# EasyEDA schematic SCH_SENSORS_IRC_2024-07-05.json
TITLE: Sheet_1; REV: 1.0; Date: 2024-07-05; Sheet: 1/1; Company: Your Company
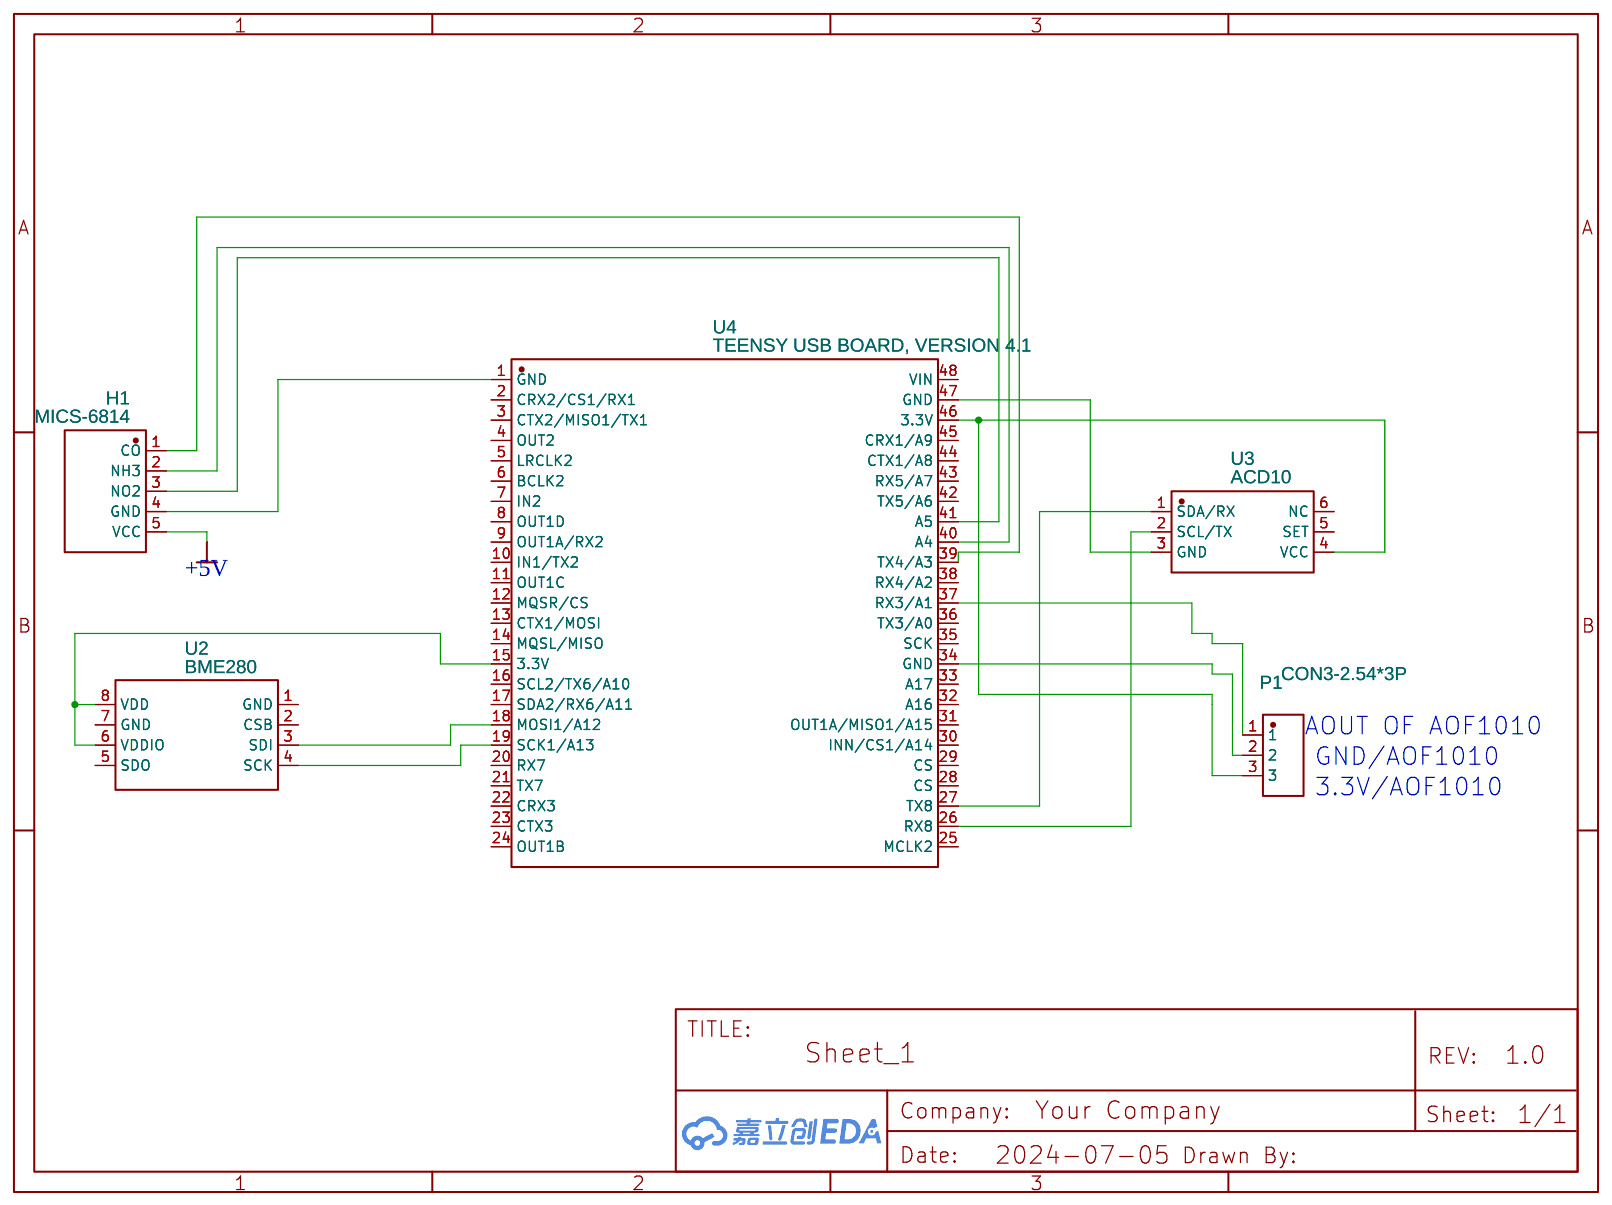
[diagram p0: schematic sheet]

## Parts
H1  MICS-6814  [MICS-6814]
P1  CON3-2.54*3P  [CONN-TH_XH2.54-3P]
U2  BME280  [LGA-8_BME280_BL]
U3  ACD10  [SENSOR-TH_ACD10]
U4  TEENSY USB BOARD, VERSION 4.1  [COMM-TH_L61.0-W17.8-P2.54]

## Library data of the parts
H1 = MICS-6814: Contributor: vbondarhuk
P1 = CON3-2.54*3P: Contributor: LCSC; Supplier: LCSC; Supplier Part: C9900003185; Manufacturer: null
U2 = BME280: Contributor: LCSC; Supplier: LCSC; Manufacturer: Bosch(博世); Supplier Part: C92489; JLCPCB Part Class: Extended Part
U3 = ACD10: Supplier: LCSC; Supplier Part: C3012634; Manufacturer: 广州奥松; Contributor: lcsc
U4 = TEENSY USB BOARD, VERSION 4.1: Supplier: LCSC; Supplier Part: C9900060513; Manufacturer: null; Contributor: lcsc; JLCPCB Part Class: Extended Part

## Nets
+5V: H1.5(VCC)
Net-(H1-1): H1.1(CO) U4.39(TX4/A3)
Net-(H1-2): H1.2(NH3) U4.40(A4)
Net-(H1-3): H1.3(NO2) U4.41(A5)
Net-(H1-4): H1.4(GND) U4.1(GND)
Net-(P1-1): P1.1 U4.37(RX3/A1)
Net-(P1-2): P1.2 U4.34(GND)
Net-(P1-3): P1.3 U3.4(VCC) U4.46(3.3V)
Net-(U2-3): U2.3(SDI) U4.18(MOSI1/A12)
Net-(U2-4): U2.4(SCK) U4.19(SCK1/A13)
Net-(U2-6): U2.6(VDDIO) U2.8(VDD) U4.15(3.3V)
Net-(U3-1): U3.1(SDA/RX) U4.27(TX8)
Net-(U3-2): U3.2(SCL/TX) U4.26(RX8)
Net-(U3-3): U3.3(GND) U4.47(GND)

Not connected (* = marked no-connect by the designer): U2 1(GND) 2(CSB) 5(SDO) 7(GND); U3 5(SET) 6(NC); U4 2(CRX2/CS1/RX1) 3(CTX2/MISO1/TX1) 4(OUT2) 5(LRCLK2) 6(BCLK2) 7(IN2) 8(OUT1D) 9(OUT1A/RX2) 10(IN1/TX2) 11(OUT1C) 12(MQSR/CS) 13(CTX1/MOSI) 14(MQSL/MISO) 16(SCL2/TX6/A10) 17(SDA2/RX6/A11) 20(RX7) 21(TX7) 22(CRX3) 23(CTX3) 24(OUT1B) 25(MCLK2) 28(CS) 29(CS) 30(INN/CS1/A14) 31(OUT1A/MISO1/A15) 32(A16) 33(A17) 35(SCK) 36(TX3/A0) 38(RX4/A2) 42(TX5/A6) 43(RX5/A7) 44(CTX1/A8) 45(CRX1/A9) 48(VIN)

## Notes on the sheet
- AOUT OF AOF1010
- GND/AOF1010
- 3.3V/AOF1010
